# Altium schematic sheet power.SchDoc
size A4; SheetNumber: 2; SheetTotal: 2
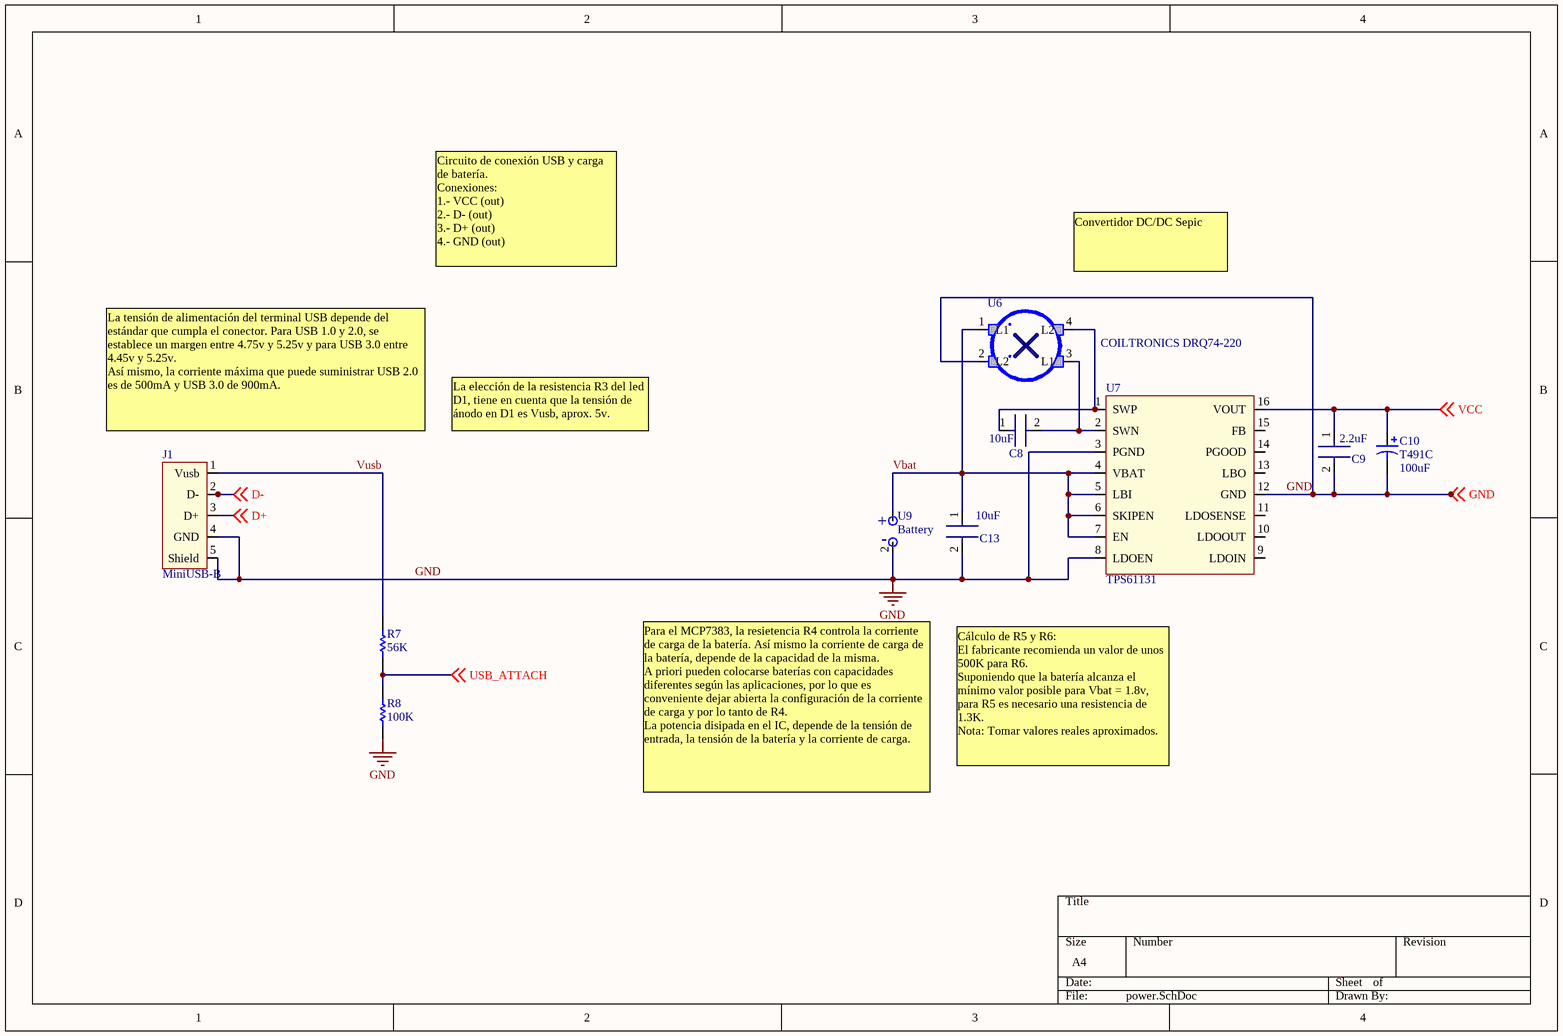
[diagram p0: power.SchDoc]

## Parts
C8  10uF  [C1206]
C9  2.2uF  [C1206]
C10  T491C  value 100uF  [C]
C13  10uF  [C1206]
J1  MiniUSB-B  [MINI USB]
R7  56K  [3216[1206]]
R8  100K  [3216[1206]]
U6  COILTRONICS DRQ74-220  [Trafo Flyback-SEPIC - soldadura manual]
U7  TPS61131  [TPS61131]
U9  Battery  [JST PH]

## Nets
GND: C9.2 C10.2 C13.2 J1.4(GND) J1.5(Shield) R8.1 U6.2(L2) U7.3(PGND) U7.8(LDOEN) U7.12(GND) U9.2 ; off-sheet GND
D+: J1.3(D+) ; off-sheet D+
D-: J1.2(D-) ; off-sheet D-
USB_ATTACH: R7.1 R8.2 ; off-sheet USB_ATTACH
Vbat: C13.1 U6.1(L1) U7.4(VBAT) U7.5(LBI) U7.6(SKIPEN) U7.7(EN) U9.1
VCC: C9.1 C10.1 U7.16(VOUT) ; off-sheet VCC
Vusb: J1.1(Vusb) R7.2
NetC8_1: C8.1 U6.4(L2) U7.1(SWP)
NetC8_2: C8.2 U6.3(L1) U7.2(SWN)

Not connected (* = marked no-connect by the designer): U7 9(LDOIN) 10(LDOOUT) 11(LDOSENSE) 13(LBO) 14(PGOOD) 15(FB)

## Notes on the sheet
- Circuito de conexión USB y carga de batería.
  Conexiones:
  1.- VCC (out)
  2.- D- (out)
  3.- D+ (out)
  4.- GND (out)
- Convertidor DC/DC Sepic
- (near J1) La tensión de alimentación del terminal USB depende del estándar que cumpla el conector. Para USB 1.0 y 2.0, se establece un margen entre 4.75v y 5.25v y para USB 3.0 entre 4.45v y 5.25v.
  Así mismo, la corriente máxima que puede suministrar USB 2.0 es de 500mA y USB 3.0 de 900mA.
- La elección de la resistencia R3 del led D1, tiene en cuenta que la tensión de ánodo en D1 es Vusb, aprox. 5v.
- Para el MCP7383, la resietencia R4 controla la corriente de carga de la batería. Así mismo la corriente de carga de la batería, depende de la capacidad de la misma.
  A priori pueden colocarse baterías con capacidades diferentes según las aplicaciones, por lo que es conveniente dejar abierta la configuración de la corriente de carga y por lo tanto de R4.
  La potencia disipada en el IC, depende de la tensión de entrada, la tensión de la batería y la corriente de carga.
- Cálculo de R5 y R6:
  El fabricante recomienda un valor de unos 500K para R6.
  Suponiendo que la batería alcanza el mínimo valor posible para Vbat = 1.8v,
  para R5 es necesario una resistencia de 1.3K.
  Nota: Tomar valores reales aproximados.
- (in symbol Battery) +; -

## Library data of the parts
C8 C9 = TDK C3216X7R1C106K
C10 = T491C: Solid Tantalum Chip Capacitor, Standard T491 Series - Industrial Grade; Published: 17-Jul-2002; LatestRevisionDate: 19-Mar-2004; LatestRevisionNote: Silkscreen dimensions re-sized.; DatasheetDocument: Mar-2001; PackageDocument: Mar-2001; PackageReference: C; Publisher: Altium Limited; Code_JEITA: 6032-28; ComponentLink1Description: Manufacturer Link; ComponentLink1URL: http://www.kemet.com/; ComponentLink2Description: Datasheet; ComponentLink2URL: http://www.kemet.com/kemet/web/homepage/kechome.nsf/vapubfilesname/F3102TA.pdf/$file/F3102TA.pdf
C13 = TDK C3216X7R1C106K: 4.7uF
R7 R8 = Res Semi: Semiconductor Resistor; Value: 1K; Published: 8-Jun-2000; LatestRevisionDate: 17-Jul-2002; LatestRevisionNote: Re-released for DXP Platform.; PackageReference: AXIAL-0.5; Publisher: Altium Limited; PackageDescription: Axial Device, Thru-Hole; 2 Leads; 0.5 in Pin Spacing